# EAGLE design PCB-Switches (EAGLE 9.5.2)
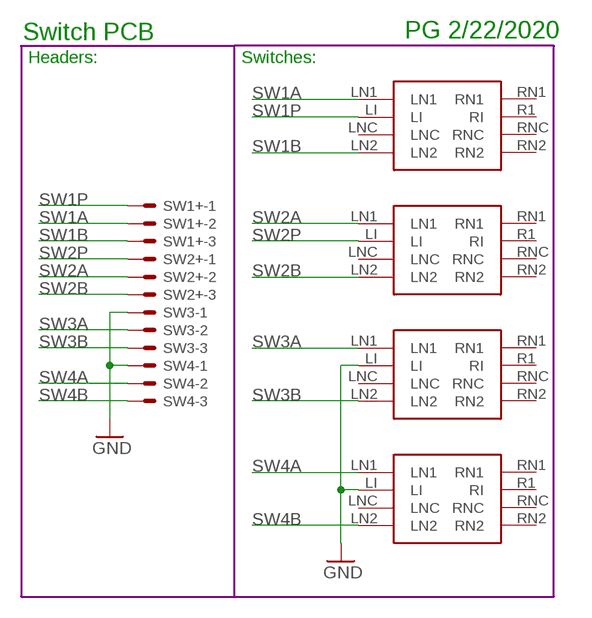
[diagram p0: schematic, sheet 1]

## Parts
SW1+  KK-156-3  [KK-156-3]
SW2+  KK-156-3  [KK-156-3]
SW3  KK-156-3  [KK-156-3]
SW4  KK-156-3  [KK-156-3]
U$1  ARCADESWITCH  [ARCADESWITCH]
U$2  ARCADESWITCH  [ARCADESWITCH]
U$3  ARCADESWITCH  [ARCADESWITCH]
U$4  ARCADESWITCH  [ARCADESWITCH]

## Nets
GND: SW3.1 SW4.1 U$3.LI U$4.LI
SW1A: SW1+.2 U$1.LN1
SW1B: SW1+.3 U$1.LN2
SW1P: SW1+.1 U$1.LI
SW2A: SW2+.2 U$2.LN1
SW2B: SW2+.3 U$2.LN2
SW2P: SW2+.1 U$2.LI
SW3A: SW3.2 U$3.LN1
SW3B: SW3.3 U$3.LN2
SW4A: SW4.2 U$4.LN1
SW4B: SW4.3 U$4.LN2
Unconnected: U$1.LNC U$1.R1(RI) U$1.RN1 U$1.RN2 U$1.RNC U$2.LNC U$2.R1(RI) U$2.RN1 U$2.RN2 U$2.RNC U$3.LNC U$3.R1(RI) U$3.RN1 U$3.RN2 U$3.RNC U$4.LNC U$4.R1(RI) U$4.RN1 U$4.RN2 U$4.RNC

## Notes on the sheet
- Switch PCB | PG 2/22/2020
- Headers: | Switches:

## Library data of the parts
SW1+ SW2+ SW3 SW4 = con-molex:KK-156-3: KK 156 HEADER Source: http://www.molex.com/pdm_docs/sd/026604100_sd.pdf; MF: MOLEX; OC_FARNELL: unknown; OC_NEWARK: unknown
U$1-U$4 = Arcade Switch:ARCADESWITCH

## Board
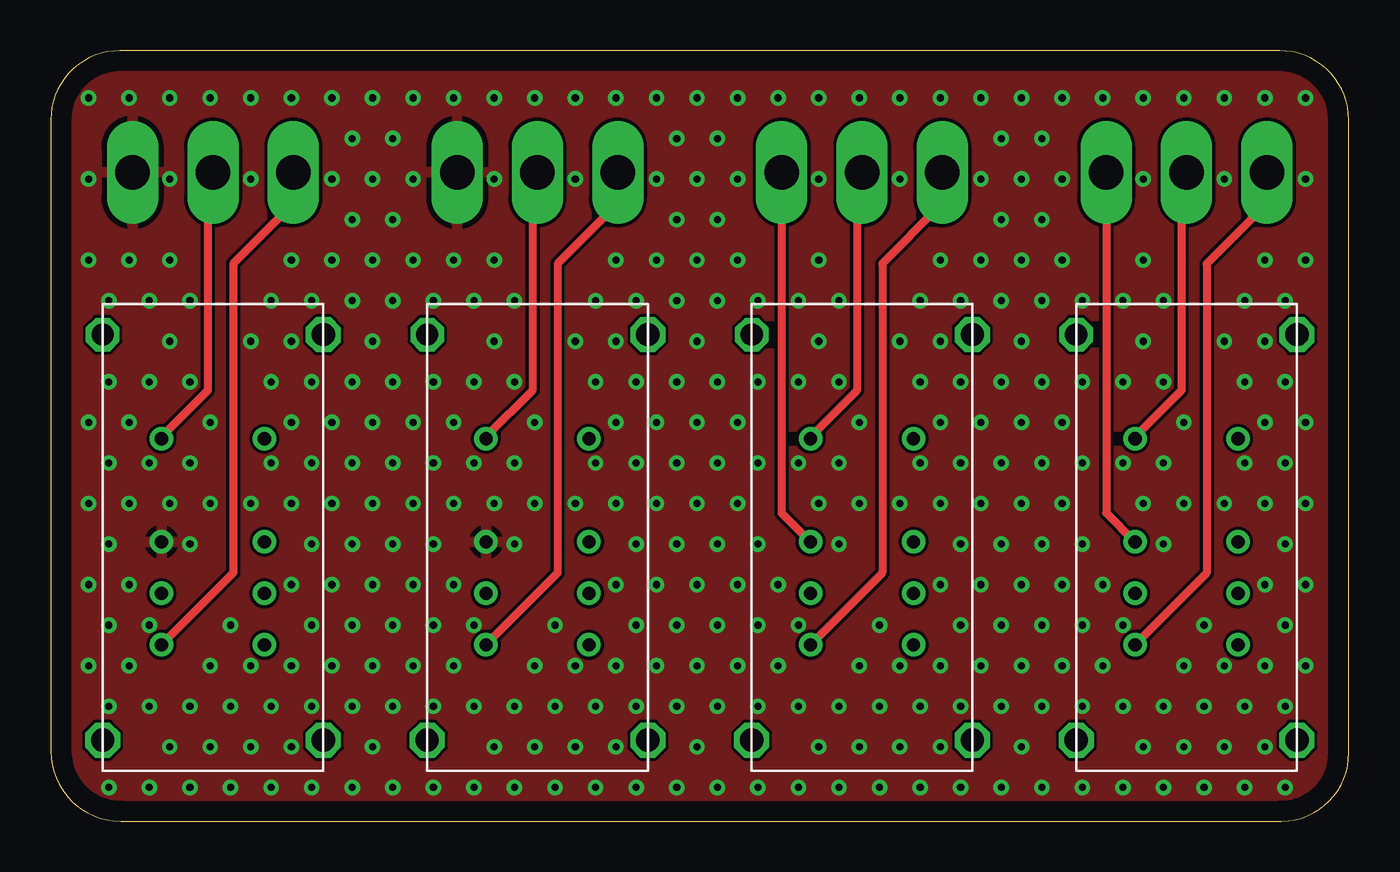
[diagram p1: board, top side]
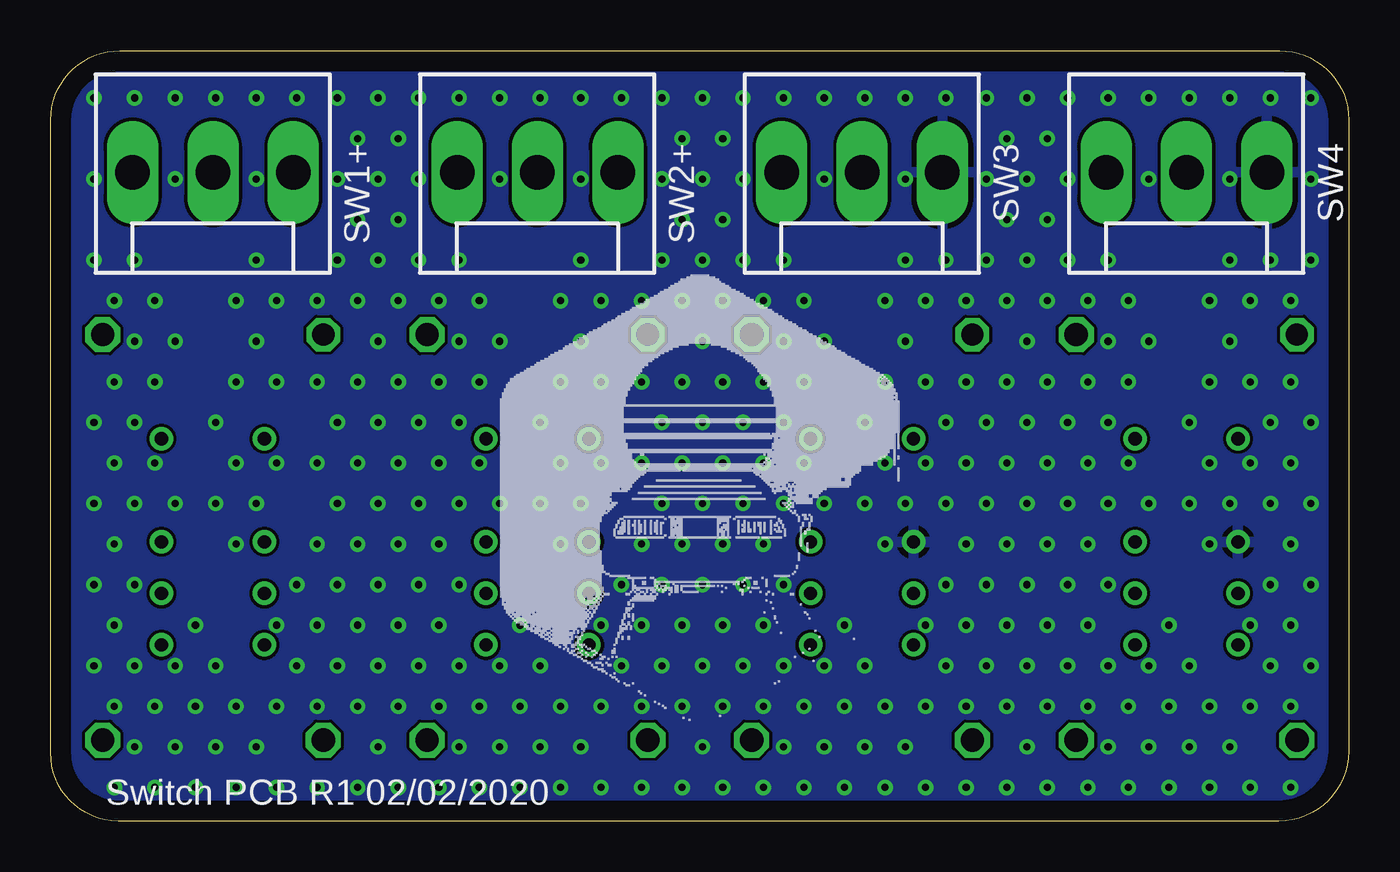
[diagram p2: board, bottom side, seen from below]

Size 64 x 38 mm. Coordinates in mm from the lower left corner, seen from the top.
Outline: 0,34.59 0,3.45 arc89 3.45,0 60.68,0 arc90 64,3.38 64,34.59 arc90 60.59,38 3.41,38 arc90 0,34.59
Copper layers (1*16): Top 0.035mm / dielectric 1.5mm / Bottom 0.035mm
Design rules "default": minimum track width 6mil, minimum drill 0.35mm, track to track 6mil, track to pad 6mil, pad to pad 6mil, via to via 6mil, smd to smd 6mil, copper to edge 40mil, drill to drill 6mil, minimum pad ring 10mil, minimum via ring 8mil, stop-mask expansion 4mil, vias tented up to drill 0.5mm, thermal gap 10mil

### Footprints (pad centres in the part's own frame; a part is rotated, then mirrored left to right if it is on the bottom)
KK-156-3 = drill 1.7 pad 2.184 long: 1 -3.96,0; 2 0,0; 3 3.96,0
ARCADESWITCH = drill 0.65: LI -2.54,-0.22; LN1 -2.54,4.86; LN2 -2.54,-5.3; LNC -2.54,-2.76; R1 2.54,-0.22; RN1 2.54,4.86; RN2 2.54,-5.3; RNC 2.54,-2.76 | drill 1.1 octagon: P$9 -5.44,10 | drill 1.15 octagon: P$10 -5.44,-10; P$11 5.44,10; P$12 5.44,-10

### Placement (x,y rotation side)
SW1+  56,32 180 bottom
SW2+  40,32 180 bottom
SW3  24,32 180 bottom
SW4  8,32 180 bottom
U$1  56,14 0 top
U$2  40,14 0 top
U$3  24,14 0 top
U$4  8,14 0 top

### Tracks (layer width: path | path; a pad name or v marks a point on that pad's centre or on a via)
GND  (via drill 0.35)
  other vias: 2.87,1.67 2.87,5.67 1.87,7.67 2.87,9.67 1.87,11.67 2.87,13.67 1.87,15.67 2.87,17.67 1.87,19.67 2.87,21.67 2.87,25.67 1.87,27.67 1.87,31.67 1.87,35.67 4.87,1.67 4.87,5.67 3.87,7.67 4.87,9.67 3.87,11.67 3.87,15.67 4.87,17.67 3.87,19.67 4.87,21.67 4.87,25.67 3.87,27.67 3.87,35.67 6.87,1.67 5.87,3.67 6.87,5.67 6.87,13.67 5.87,15.67 6.87,17.67 6.87,21.67 5.87,23.67 6.87,25.67 5.87,27.67 5.87,31.67 5.87,35.67 8.87,1.67 7.87,3.67 8.87,5.67 7.87,7.67 8.87,9.67 7.87,15.67 7.87,19.67 7.87,35.67 10.87,1.67 9.87,3.67 10.87,5.67 9.87,7.67 9.87,15.67 10.87,17.67 10.87,21.67 9.87,23.67 10.87,25.67 9.87,31.67 9.87,35.67 12.87,1.67 11.87,3.67 12.87,5.67 11.87,7.67 12.87,9.67 11.87,11.67 12.87,13.67 11.87,15.67 12.87,17.67 11.87,19.67 12.87,21.67 11.87,23.67 12.87,25.67 11.87,27.67 11.87,35.67 14.87,1.67 14.87,5.67 13.87,7.67 14.87,9.67 13.87,11.67 14.87,13.67 13.87,15.67 14.87,17.67 13.87,19.67 14.87,21.67 14.87,25.67 13.87,27.67 14.87,29.67 13.87,31.67 14.87,33.67 13.87,35.67 16.87,1.67 15.87,3.67 16.87,5.67 15.87,7.67 16.87,9.67 15.87,11.67 16.87,13.67 15.87,15.67 16.87,17.67 15.87,19.67 16.87,21.67 15.87,23.67 16.87,25.67 15.87,27.67 16.87,29.67 15.87,31.67 16.87,33.67 15.87,35.67 18.87,1.67 18.87,5.67 17.87,7.67 18.87,9.67 17.87,11.67 18.87,13.67 17.87,15.67 18.87,17.67 17.87,19.67 18.87,21.67 18.87,25.67 17.87,27.67 17.87,31.67 17.87,35.67 20.87,1.67 20.87,5.67 19.87,7.67 20.87,9.67 19.87,11.67 19.87,15.67 20.87,17.67 19.87,19.67 20.87,21.67 20.87,25.67 19.87,27.67 19.87,35.67 22.87,1.67 21.87,3.67 22.87,5.67 22.87,13.67 21.87,15.67 22.87,17.67 22.87,21.67 21.87,23.67 22.87,25.67 21.87,27.67 21.87,31.67 21.87,35.67 24.87,1.67 23.87,3.67 24.87,5.67 23.87,7.67 24.87,9.67 23.87,15.67 23.87,19.67 23.87,35.67 26.87,1.67 25.87,3.67 26.87,5.67 25.87,7.67 25.87,15.67 26.87,17.67 26.87,21.67 25.87,23.67 26.87,25.67 25.87,31.67 25.87,35.67 28.87,1.67 27.87,3.67 28.87,5.67 27.87,7.67 28.87,9.67 27.87,11.67 28.87,13.67 27.87,15.67 28.87,17.67 27.87,19.67 28.87,21.67 27.87,23.67 28.87,25.67 27.87,27.67 27.87,35.67 30.87,1.67 30.87,5.67 29.87,7.67 30.87,9.67 29.87,11.67 30.87,13.67 29.87,15.67 30.87,17.67 29.87,19.67 30.87,21.67 30.87,25.67 29.87,27.67 30.87,29.67 29.87,31.67 30.87,33.67 29.87,35.67 32.87,1.67 31.87,3.67 32.87,5.67 31.87,7.67 32.87,9.67 31.87,11.67 32.87,13.67 31.87,15.67 32.87,17.67 31.87,19.67 32.87,21.67 31.87,23.67 32.87,25.67 31.87,27.67 32.87,29.67 31.87,31.67 32.87,33.67 31.87,35.67 34.87,1.67 34.87,5.67 33.87,7.67 34.87,9.67 33.87,11.67 34.87,13.67 33.87,15.67 34.87,17.67 33.87,19.67 34.87,21.67 34.87,25.67 33.87,27.67 33.87,31.67 33.87,35.67 36.87,1.67 36.87,5.67 35.87,7.67 36.87,9.67 35.87,11.67 36.87,17.67 36.87,21.67 36.87,25.67 35.87,35.67 38.87,1.67 37.87,3.67 38.87,5.67 38.87,13.67 37.87,15.67 38.87,17.67 38.87,21.67 37.87,23.67 38.87,25.67 37.87,27.67 37.87,31.67 37.87,35.67 40.87,1.67 39.87,3.67 40.87,5.67 39.87,7.67 40.87,9.67 39.87,15.67 39.87,19.67 39.87,35.67 42.87,1.67 41.87,3.67 42.87,5.67 41.87,7.67 41.87,15.67 42.87,17.67 42.87,21.67 41.87,23.67 42.87,25.67 41.87,31.67 41.87,35.67 44.87,1.67 43.87,3.67 44.87,5.67 43.87,7.67 44.87,9.67 43.87,11.67 44.87,13.67 43.87,15.67 44.87,17.67 43.87,19.67 44.87,21.67 43.87,23.67 44.87,25.67 43.87,27.67 43.87,35.67 46.87,1.67 46.87,5.67 45.87,7.67 46.87,9.67 45.87,11.67 46.87,13.67 45.87,15.67 46.87,17.67 45.87,19.67 46.87,21.67 46.87,25.67 45.87,27.67 46.87,29.67 45.87,31.67 46.87,33.67 45.87,35.67 48.87,1.67 47.87,3.67 48.87,5.67 47.87,7.67 48.87,9.67 47.87,11.67 48.87,13.67 47.87,15.67 48.87,17.67 47.87,19.67 48.87,21.67 47.87,23.67 48.87,25.67 47.87,27.67 48.87,29.67 47.87,31.67 48.87,33.67 47.87,35.67 50.87,1.67 50.87,5.67 49.87,7.67 50.87,9.67 49.87,11.67 50.87,13.67 49.87,15.67 50.87,17.67 49.87,19.67 50.87,21.67 50.87,25.67 49.87,27.67 49.87,31.67 49.87,35.67 52.87,1.67 52.87,5.67 51.87,7.67 52.87,9.67 51.87,11.67 52.87,17.67 52.87,21.67 52.87,25.67 51.87,35.67 54.87,1.67 53.87,3.67 54.87,5.67 54.87,13.67 53.87,15.67 54.87,17.67 54.87,21.67 53.87,23.67 54.87,25.67 53.87,27.67 53.87,31.67 53.87,35.67 56.87,1.67 55.87,3.67 56.87,5.67 55.87,7.67 56.87,9.67 55.87,15.67 55.87,19.67 55.87,35.67 58.87,1.67 57.87,3.67 58.87,5.67 57.87,7.67 57.87,15.67 58.87,17.67 58.87,21.67 57.87,23.67 58.87,25.67 57.87,31.67 57.87,35.67 60.87,1.67 59.87,3.67 60.87,5.67 59.87,7.67 60.87,9.67 59.87,11.67 60.87,13.67 59.87,15.67 60.87,17.67 59.87,19.67 60.87,21.67 59.87,23.67 60.87,25.67 59.87,27.67 59.87,35.67 61.87,7.67 61.87,11.67 61.87,15.67 61.87,19.67 61.87,27.67 61.87,31.67 61.87,35.67
  pour Bottom: 0,0 0,38 64,38 64,0
  pour Top: 0,0 0,38 64,38 64,0
SW1A
  Top 0.406: SW1+.2 55.75,31.75 55.75,21.25 53.5,19 U$1.LN1
SW1B
  Top 0.406: U$1.LN2 53.5,8.75 57,12.25 57,27.5 59.75,30.25 59.75,32 SW1+.3
SW1P
  Top 0.406: SW1+.1 52.04,15.2 U$1.LI
SW2A
  Top 0.406: SW2+.2 39.75,31.75 39.75,21.25 37.5,19 U$2.LN1
SW2B
  Top 0.406: U$2.LN2 37.5,8.75 41,12.25 41,27.5 43.75,30.25 43.75,32 SW2+.3
SW2P
  Top 0.406: SW2+.1 36.04,15.2 U$2.LI
SW3A
  Top 0.406: SW3.2 23.75,31.75 23.75,21.25 21.5,19 U$3.LN1
SW3B
  Top 0.406: U$3.LN2 21.5,8.75 25,12.25 25,27.5 27.75,30.25 27.75,32 SW3.3
SW4A
  Top 0.406: SW4.2 7.75,31.75 7.75,21.25 5.5,19 U$4.LN1
SW4B
  Top 0.406: U$4.LN2 5.5,8.75 9,12.25 9,27.5 11.75,30.25 11.75,32 SW4.3

### Text on the board
bPlace: Switch PCB R1 02/02/2020